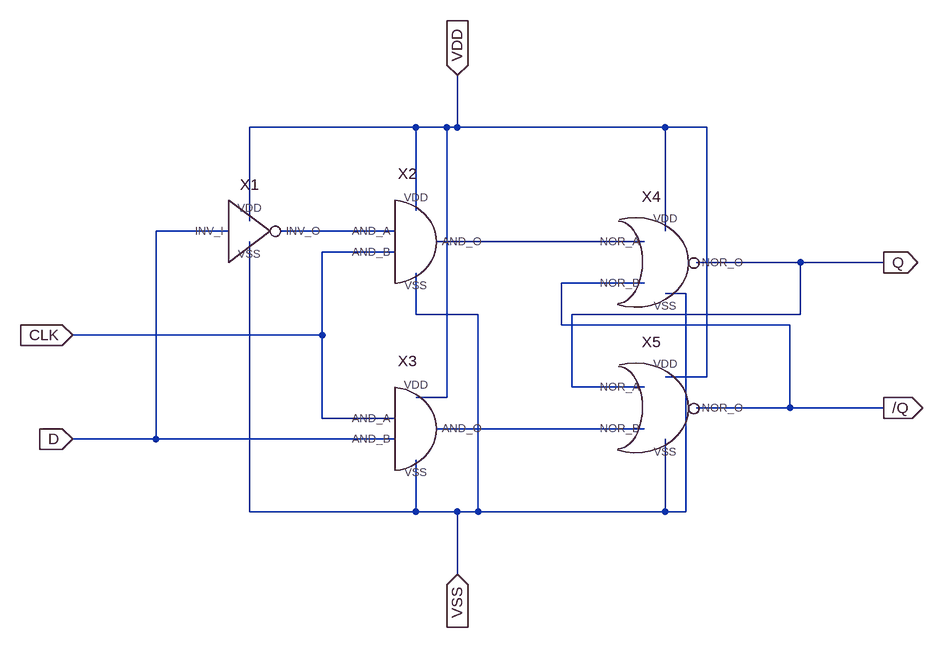
[diagram p0: schematic m_DQ_ff.asc]
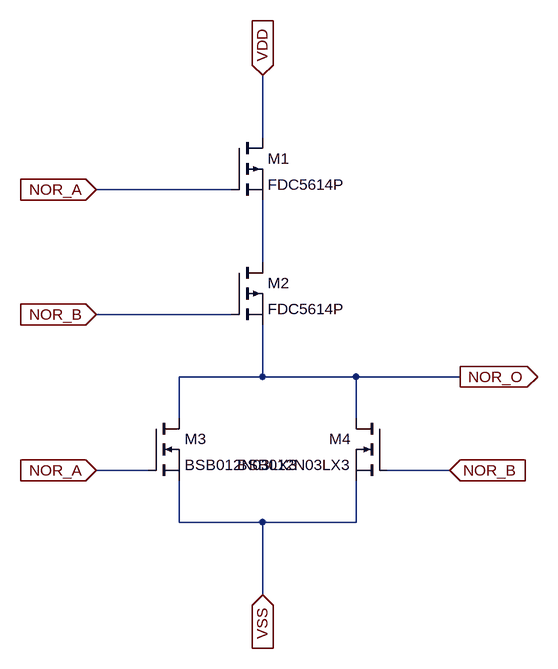
[diagram p1: sub-circuit m_nor.asc]
m_DQ_ff.asc, the LTspice schematic file:
Version 4
SHEET 1 1180 748
WIRE 368 -48 112 -48
WIRE 416 -48 368 -48
WIRE 432 -48 432 -128
WIRE 432 -48 416 -48
WIRE 752 -48 432 -48
WIRE 816 -48 752 -48
WIRE 368 80 368 -48
WIRE 112 96 112 -48
WIRE 80 112 -32 112
WIRE 336 112 160 112
WIRE 752 112 752 -48
WIRE 720 128 400 128
WIRE 336 144 224 144
WIRE 960 160 800 160
WIRE 1088 160 960 160
WIRE 720 192 592 192
WIRE 784 208 752 208
WIRE 368 240 368 176
WIRE 464 240 368 240
WIRE 960 240 960 160
WIRE 960 240 608 240
WIRE 592 256 592 192
WIRE 944 256 592 256
WIRE 224 272 224 144
WIRE 224 272 -160 272
WIRE 816 336 816 -48
WIRE 816 336 752 336
WIRE 608 352 608 240
WIRE 720 352 608 352
WIRE 416 368 416 -48
WIRE 416 368 368 368
WIRE 944 384 944 256
WIRE 944 384 800 384
WIRE 1088 384 944 384
WIRE 224 400 224 272
WIRE 336 400 224 400
WIRE 720 416 400 416
WIRE -32 432 -32 112
WIRE -32 432 -160 432
WIRE 336 432 -32 432
WIRE 112 544 112 128
WIRE 368 544 368 464
WIRE 368 544 112 544
WIRE 432 544 368 544
WIRE 464 544 464 240
WIRE 464 544 432 544
WIRE 752 544 752 432
WIRE 752 544 464 544
WIRE 784 544 784 208
WIRE 784 544 752 544
WIRE 432 640 432 544
FLAG 432 -128 VDD
IOPIN 432 -128 In
FLAG 432 640 VSS
IOPIN 432 640 In
FLAG 1088 160 Q
IOPIN 1088 160 Out
FLAG 1088 384 /Q
IOPIN 1088 384 Out
FLAG -160 432 D
IOPIN -160 432 In
FLAG -160 272 CLK
IOPIN -160 272 In
SYMBOL m_Inverter 112 112 R0
SYMATTR InstName X1
SYMBOL m_And 400 128 R0
SYMATTR InstName X2
SYMBOL m_And 400 416 R0
SYMATTR InstName X3
SYMBOL m_Nor 800 160 R0
SYMATTR InstName X4
SYMBOL m_Nor 800 384 R0
SYMATTR InstName X5

m_nor.asc, the sub-circuit schematic file:
Version 4
SHEET 1 880 680
WIRE 144 -224 144 -320
WIRE 96 -144 -112 -144
WIRE 144 -32 144 -128
WIRE 96 48 -112 48
WIRE 144 144 144 64
WIRE 144 144 16 144
WIRE 288 144 144 144
WIRE 448 144 288 144
WIRE 16 208 16 144
WIRE 288 208 288 144
WIRE -32 288 -112 288
WIRE 432 288 336 288
WIRE 16 368 16 304
WIRE 144 368 16 368
WIRE 288 368 288 304
WIRE 288 368 144 368
WIRE 144 480 144 368
FLAG 144 480 VSS
IOPIN 144 480 In
FLAG 144 -320 VDD
IOPIN 144 -320 In
FLAG 448 144 NOR_O
IOPIN 448 144 Out
FLAG -112 288 NOR_A
IOPIN -112 288 In
FLAG -112 -144 NOR_A
IOPIN -112 -144 In
FLAG -112 48 NOR_B
IOPIN -112 48 In
FLAG 432 288 NOR_B
IOPIN 432 288 In
SYMBOL pmos 96 -224 R0
SYMATTR InstName M1
SYMATTR Value FDC5614P
SYMBOL pmos 96 -32 R0
SYMATTR InstName M2
SYMATTR Value FDC5614P
SYMBOL nmos -32 208 R0
SYMATTR InstName M3
SYMATTR Value BSB012N03LX3
SYMBOL nmos 336 208 M0
SYMATTR InstName M4
SYMATTR Value BSB012N03LX3

The netlist it stands for:
* m_DQ_ff.asc
XX1 D VDD VSS N001 m_Inverter  ; pins INV_I VDD VSS INV_O
XX2 N001 CLK VDD VSS N002 m_And  ; pins AND_A AND_B VDD VSS AND_O
XX3 CLK D VDD VSS N003 m_And  ; pins AND_A AND_B VDD VSS AND_O
XX4 N002 /Q VDD VSS Q m_nor
XX5 Q N003 VDD VSS /Q m_nor

* block symbol definitions
.subckt m_nor NOR_A NOR_B VDD VSS NOR_O
M1 VDD NOR_A N001 N001 FDC5614P
M2 N001 NOR_B NOR_O NOR_O FDC5614P
M3 NOR_O NOR_A VSS VSS BSB012N03LX3
M4 NOR_O NOR_B VSS VSS BSB012N03LX3
.ends m_nor

.model NMOS NMOS
.model PMOS PMOS
.lib standard.mos
.backanno
.end